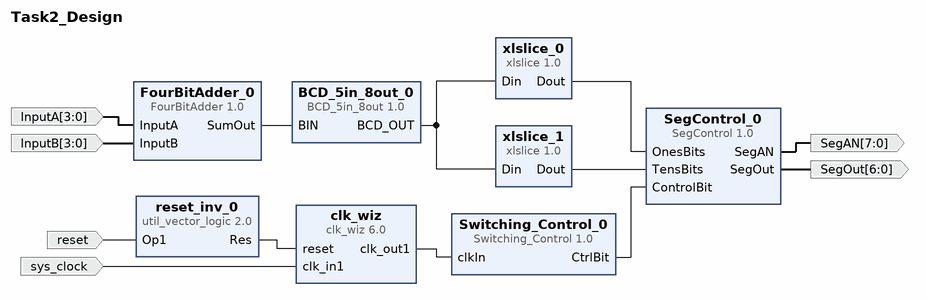
[diagram p0: block diagram of the top level]
# Vivado block design Task2_Design, xc7a100tcsg324-1, Vivado 2023.1
create_bd_design Task2_Design

create_bd_port -dir I -type clk sys_clock
set_property -dict {CONFIG.FREQ_HZ 100000000 CONFIG.PHASE 0.0} [get_bd_ports sys_clock]
create_bd_port -dir I -type rst reset
set_property -dict {CONFIG.POLARITY ACTIVE_LOW} [get_bd_ports reset]
create_bd_port -dir O -from 6 -to 0 SegOut
create_bd_port -dir O -from 7 -to 0 SegAN
create_bd_port -dir I -from 3 -to 0 InputA
create_bd_port -dir I -from 3 -to 0 InputB

create_bd_cell -type ip -vlnv Youssef:user:FourBitAdder:1.0 FourBitAdder_0
create_bd_cell -type ip -vlnv Youssef:user:BCD_5in_8out:1.0 BCD_5in_8out_0
create_bd_cell -type ip -vlnv Youssef:user:SegControl:1.0 SegControl_0
create_bd_cell -type ip -vlnv xilinx.com:ip:xlslice:1.0 xlslice_0
set_property -dict {CONFIG.DIN_FROM 3 CONFIG.DIN_WIDTH 8} [get_bd_cells xlslice_0]
create_bd_cell -type ip -vlnv xilinx.com:ip:xlslice:1.0 xlslice_1
set_property -dict {CONFIG.DIN_FROM 7 CONFIG.DIN_TO 4 CONFIG.DIN_WIDTH 8} [get_bd_cells xlslice_1]
create_bd_cell -type ip -vlnv hshl.net:user:Switching_Control:1.0 Switching_Control_0
create_bd_cell -type ip -vlnv xilinx.com:ip:clk_wiz:6.0 clk_wiz
set_property -dict [list \
  CONFIG.CLK_IN1_BOARD_INTERFACE sys_clock \
  CONFIG.RESET_BOARD_INTERFACE reset \
  CONFIG.USE_BOARD_FLOW true \
] [get_bd_cells clk_wiz]
create_bd_cell -type ip -vlnv xilinx.com:ip:util_vector_logic:2.0 reset_inv_0
set_property -dict {CONFIG.C_OPERATION not CONFIG.C_SIZE 1} [get_bd_cells reset_inv_0]

# ---- connections ----

connect_bd_net [get_bd_pins BCD_5in_8out_0/BCD_OUT] [get_bd_pins xlslice_0/Din] [get_bd_pins xlslice_1/Din]
connect_bd_net [get_bd_pins FourBitAdder_0/SumOut] [get_bd_pins BCD_5in_8out_0/BIN]
connect_bd_net [get_bd_ports InputA] [get_bd_pins FourBitAdder_0/InputA]
connect_bd_net [get_bd_ports InputB] [get_bd_pins FourBitAdder_0/InputB]
connect_bd_net [get_bd_pins SegControl_0/SegAN] [get_bd_ports SegAN]
connect_bd_net [get_bd_pins SegControl_0/SegOut] [get_bd_ports SegOut]
connect_bd_net [get_bd_pins Switching_Control_0/CtrlBit] [get_bd_pins SegControl_0/ControlBit]
connect_bd_net [get_bd_pins clk_wiz/clk_out1] [get_bd_pins Switching_Control_0/clkIn]
connect_bd_net [get_bd_ports reset] [get_bd_pins reset_inv_0/Op1]
connect_bd_net [get_bd_pins reset_inv_0/Res] [get_bd_pins clk_wiz/reset]
connect_bd_net [get_bd_ports sys_clock] [get_bd_pins clk_wiz/clk_in1]
connect_bd_net [get_bd_pins xlslice_0/Dout] [get_bd_pins SegControl_0/OnesBits]
connect_bd_net [get_bd_pins xlslice_1/Dout] [get_bd_pins SegControl_0/TensBits]

validate_bd_design
save_bd_design
